# EAGLE design high-power-supply (EAGLE 7.7.0)
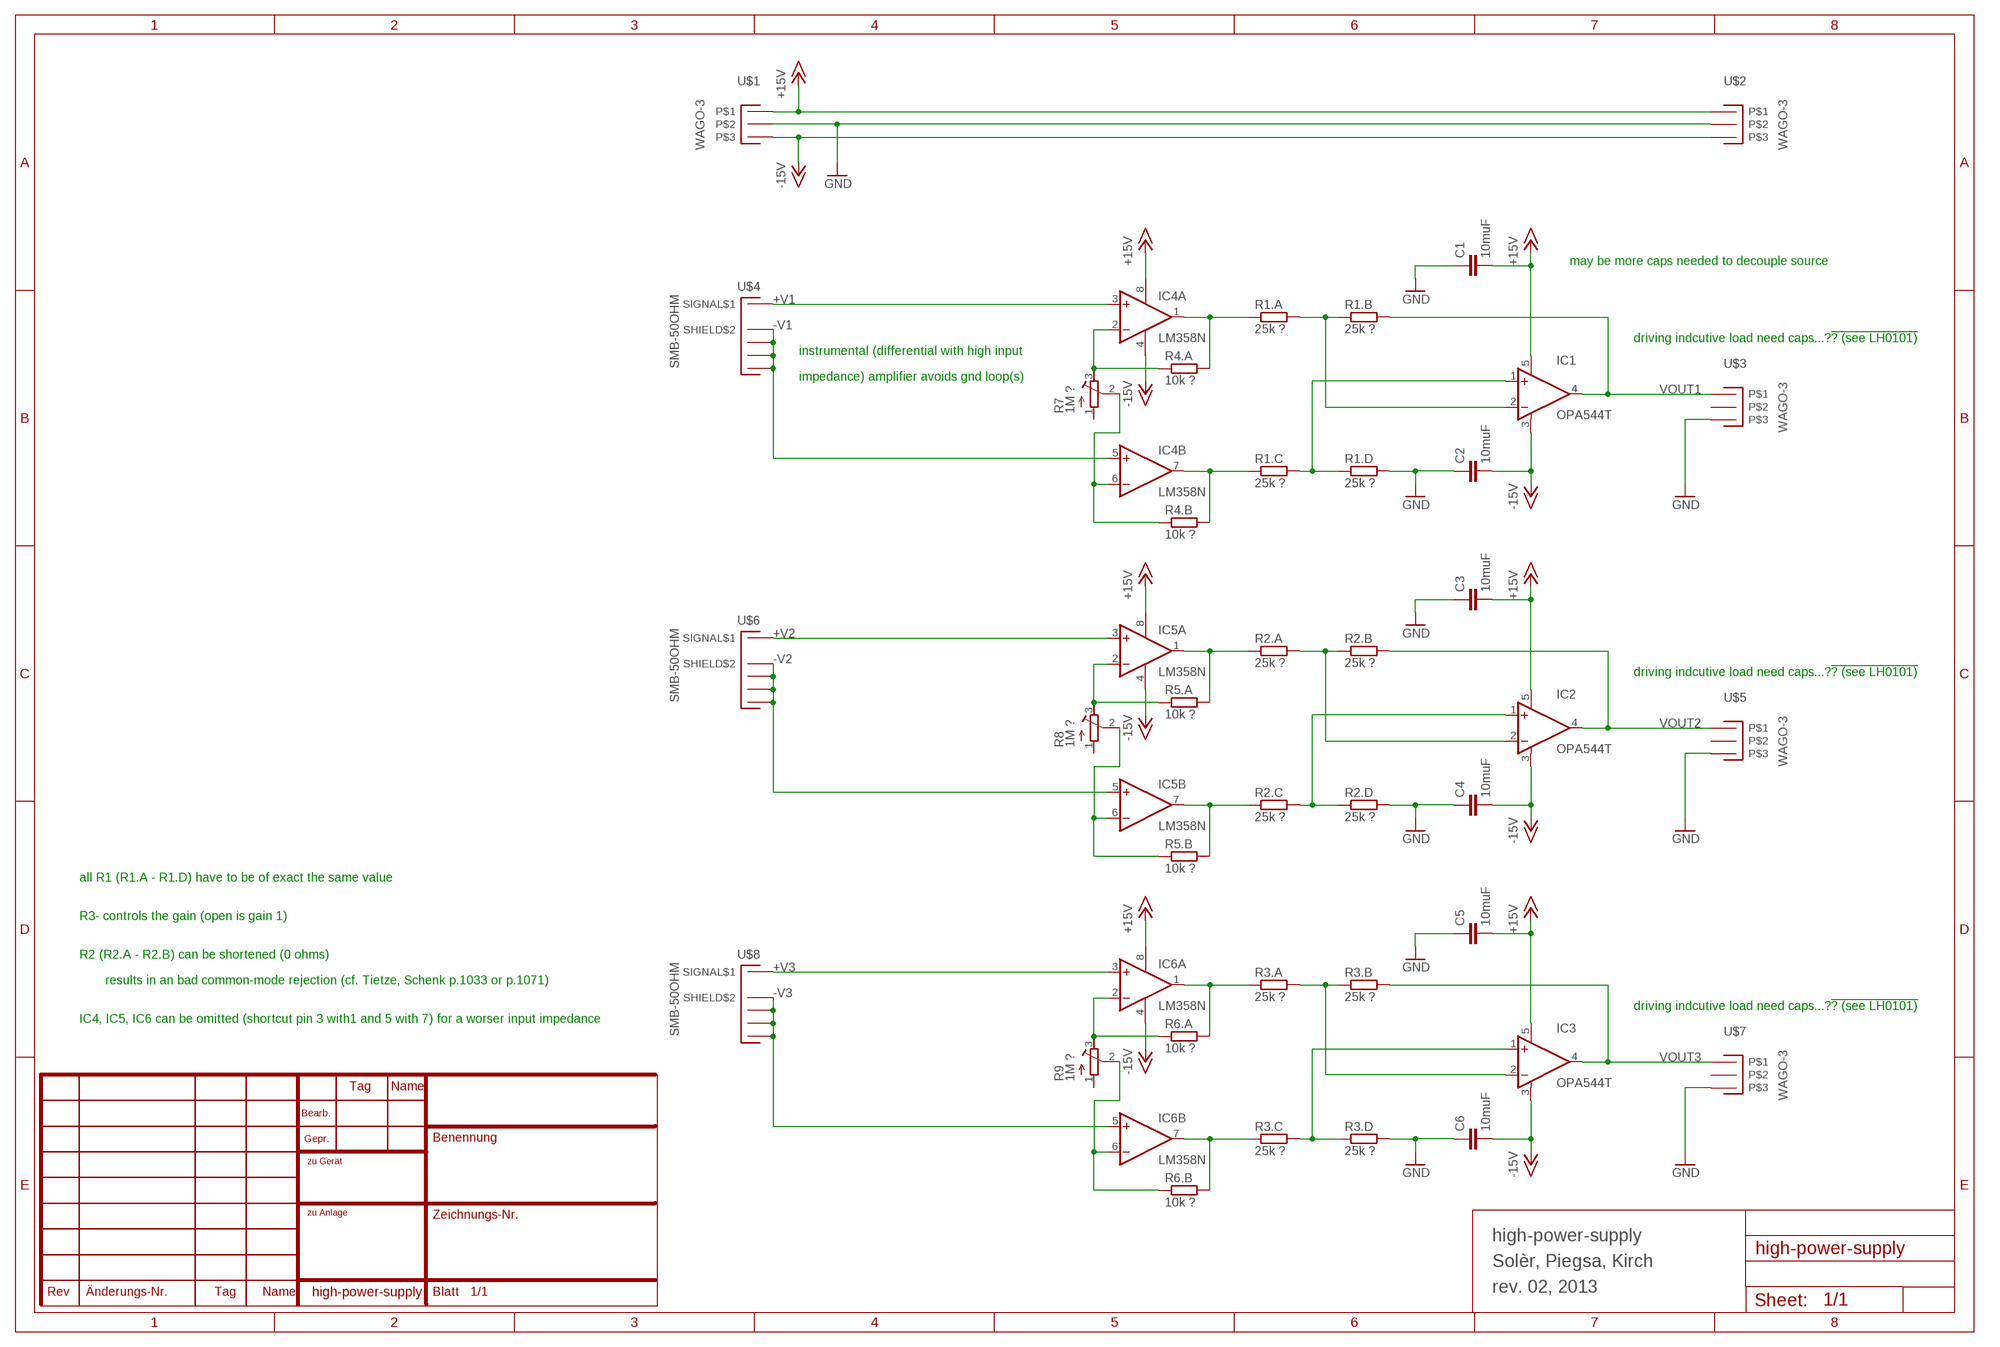
[diagram p0: schematic, sheet 1]

## Parts
C1  10muF  C-EU050-025X075  [C050-025X075]
C2  10muF  C-EU050-025X075  [C050-025X075]
C3  10muF  C-EU050-025X075  [C050-025X075]
C4  10muF  C-EU050-025X075  [C050-025X075]
C5  10muF  C-EU050-025X075  [C050-025X075]
C6  10muF  C-EU050-025X075  [C050-025X075]
IC1  OPA544T  [TO220-G5]
IC2  OPA544T  [TO220-G5]
IC3  OPA544T  [TO220-G5]
IC4  LM358N  [DIL08]
IC5  LM358N  [DIL08]
IC6  LM358N  [DIL08]
R1.A  25k ?  R-EU_0207/12  [0207/12]
R1.B  25k ?  R-EU_0207/12  [0207/12]
R1.C  25k ?  R-EU_0207/12  [0207/12]
R1.D  25k ?  R-EU_0207/12  [0207/12]
R2.A  25k ?  R-EU_0207/12  [0207/12]
R2.B  25k ?  R-EU_0207/12  [0207/12]
R2.C  25k ?  R-EU_0207/12  [0207/12]
R2.D  25k ?  R-EU_0207/12  [0207/12]
R3.A  25k ?  R-EU_0207/12  [0207/12]
R3.B  25k ?  R-EU_0207/12  [0207/12]
R3.C  25k ?  R-EU_0207/12  [0207/12]
R3.D  25k ?  R-EU_0207/12  [0207/12]
R4.A  10k ?  R-EU_0207/12  [0207/12]
R4.B  10k ?  R-EU_0207/12  [0207/12]
R5.A  10k ?  R-EU_0207/12  [0207/12]
R5.B  10k ?  R-EU_0207/12  [0207/12]
R6.A  10k ?  R-EU_0207/12  [0207/12]
R6.B  10k ?  R-EU_0207/12  [0207/12]
R7  1M ?  R-TRIMM3296Y  [RTRIM3296Y]
R8  1M ?  R-TRIMM3296Y  [RTRIM3296Y]
R9  1M ?  R-TRIMM3296Y  [RTRIM3296Y]
U$1  WAGO-3  [WAGO-3]
U$2  WAGO-3  [WAGO-3]
U$3  WAGO-3  [WAGO-3]
U$4  SMB-50OHM  [B-30]
U$5  WAGO-3  [WAGO-3]
U$6  SMB-50OHM  [B-30]
U$7  WAGO-3  [WAGO-3]
U$8  SMB-50OHM  [B-30]

## Nets
+15V: C1.2 C3.2 C5.2 IC1.5(V+) IC2.5(V+) IC3.5(V+) IC4.8(P:V+) IC5.8(P:V+) IC6.8(P:V+) U$1.P$1 U$2.P$1
+V1: IC4.3(A:+IN) U$4.P$1(SIGNAL$1)
+V2: IC5.3(A:+IN) U$6.P$1(SIGNAL$1)
+V3: IC6.3(A:+IN) U$8.P$1(SIGNAL$1)
-15V: C2.2 C4.2 C6.2 IC1.3(V-) IC2.3(V-) IC3.3(V-) IC4.4(P:V-) IC5.4(P:V-) IC6.4(P:V-) U$1.P$3 U$2.P$3
-V1: IC4.5(B:+IN) U$4.P$2(SHIELD$2) U$4.P$3(SHIELD$3) U$4.P$4(SHIELD$4) U$4.P$5(SHIELD$5)
-V2: IC5.5(B:+IN) U$6.P$2(SHIELD$2) U$6.P$3(SHIELD$3) U$6.P$4(SHIELD$4) U$6.P$5(SHIELD$5)
-V3: IC6.5(B:+IN) U$8.P$2(SHIELD$2) U$8.P$3(SHIELD$3) U$8.P$4(SHIELD$4) U$8.P$5(SHIELD$5)
GND: C1.1 C2.1 C3.1 C4.1 C5.1 C6.1 R1.D.2 R2.D.2 R3.D.2 U$1.P$2 U$2.P$2 U$3.P$3 U$5.P$3 U$7.P$3
N$2: IC1.2(-IN) R1.A.2 R1.B.1
N$4: IC1.1(+IN) R1.C.2 R1.D.1
N$10: IC4.2(A:-IN) R4.A.1 R7.3(E)
N$11: IC4.1(A:OUT) R1.A.1 R4.A.2
N$12: IC4.6(B:-IN) R4.B.1 R7.2(S)
N$13: IC4.7(B:OUT) R1.C.1 R4.B.2
N$16: IC5.2(A:-IN) R5.A.1 R8.3(E)
N$17: IC5.1(A:OUT) R2.A.1 R5.A.2
N$18: IC5.6(B:-IN) R5.B.1 R8.2(S)
N$19: IC5.7(B:OUT) R2.C.1 R5.B.2
N$20: IC2.2(-IN) R2.A.2 R2.B.1
N$21: IC2.1(+IN) R2.C.2 R2.D.1
N$24: IC6.2(A:-IN) R6.A.1 R9.3(E)
N$25: IC6.1(A:OUT) R3.A.1 R6.A.2
N$26: IC6.6(B:-IN) R6.B.1 R9.2(S)
N$27: IC6.7(B:OUT) R3.C.1 R6.B.2
N$28: IC3.2(-IN) R3.A.2 R3.B.1
N$29: IC3.1(+IN) R3.C.2 R3.D.1
VOUT1: IC1.4(OUT) R1.B.2 U$3.P$1
VOUT2: IC2.4(OUT) R2.B.2 U$5.P$1
VOUT3: IC3.4(OUT) R3.B.2 U$7.P$1
Unconnected: R7.1(A) R8.1(A) R9.1(A) U$3.P$2 U$5.P$2 U$7.P$2

## Notes on the sheet
- may be more caps needed to decouple source
- driving indcutive load need caps...?!? (see LH0101)
- instrumental (differential with high input
- impedance) amplifier avoids gnd loop(s)
- driving indcutive load need caps...?!? (see LH0101)
- all R1 (R1.A - R1.D) have to be of exact the same value
- R3- controls the gain (open is gain 1)
- R2 (R2.A - R2.B) can be shortened (0 ohms)
- results in an bad common-mode rejection (cf. Tietze, Schenk p.1033 or p.1071)
- driving indcutive load need caps...?!? (see LH0101)
- IC4, IC5, IC6 can be omitted (shortcut pin 3 with1 and 5 with 7) for a worser input impedance
- high-power-supply
- Solèr, Piegsa, Kirch
- rev. 02, 2013

## Library data of the parts
C1-C6 = rcl:C-EU: CAPACITOR, European symbol
IC1-IC3 = burr-brown:OPA544: Operational Amplifier High-Voltage, High-Current; MF: TEXAS INSTRUMENTS; MPN: OPA544T; OC_FARNELL: 1097575; OC_NEWARK: 36K2005
IC4-IC6 = linear:LM358: OP AMP also LM158; LM258; LM2904 Source: http://cache.national.com/ds/LM/LM158.pdf
R1.A R1.B R1.C R1.D R2.A R2.B R2.C R2.D R3.A R3.B R3.C R3.D R4.A R4.B R5.A R5.B R6.A R6.B = rcl:R-EU_: RESISTOR, European symbol
R7-R9 = rcl:R-TRIMM: Trimm resistor
U$1-U$3 U$5 U$7 = parts:WAGO-3
U$4 U$6 U$8 = parts:SMB-50OHM

## Board
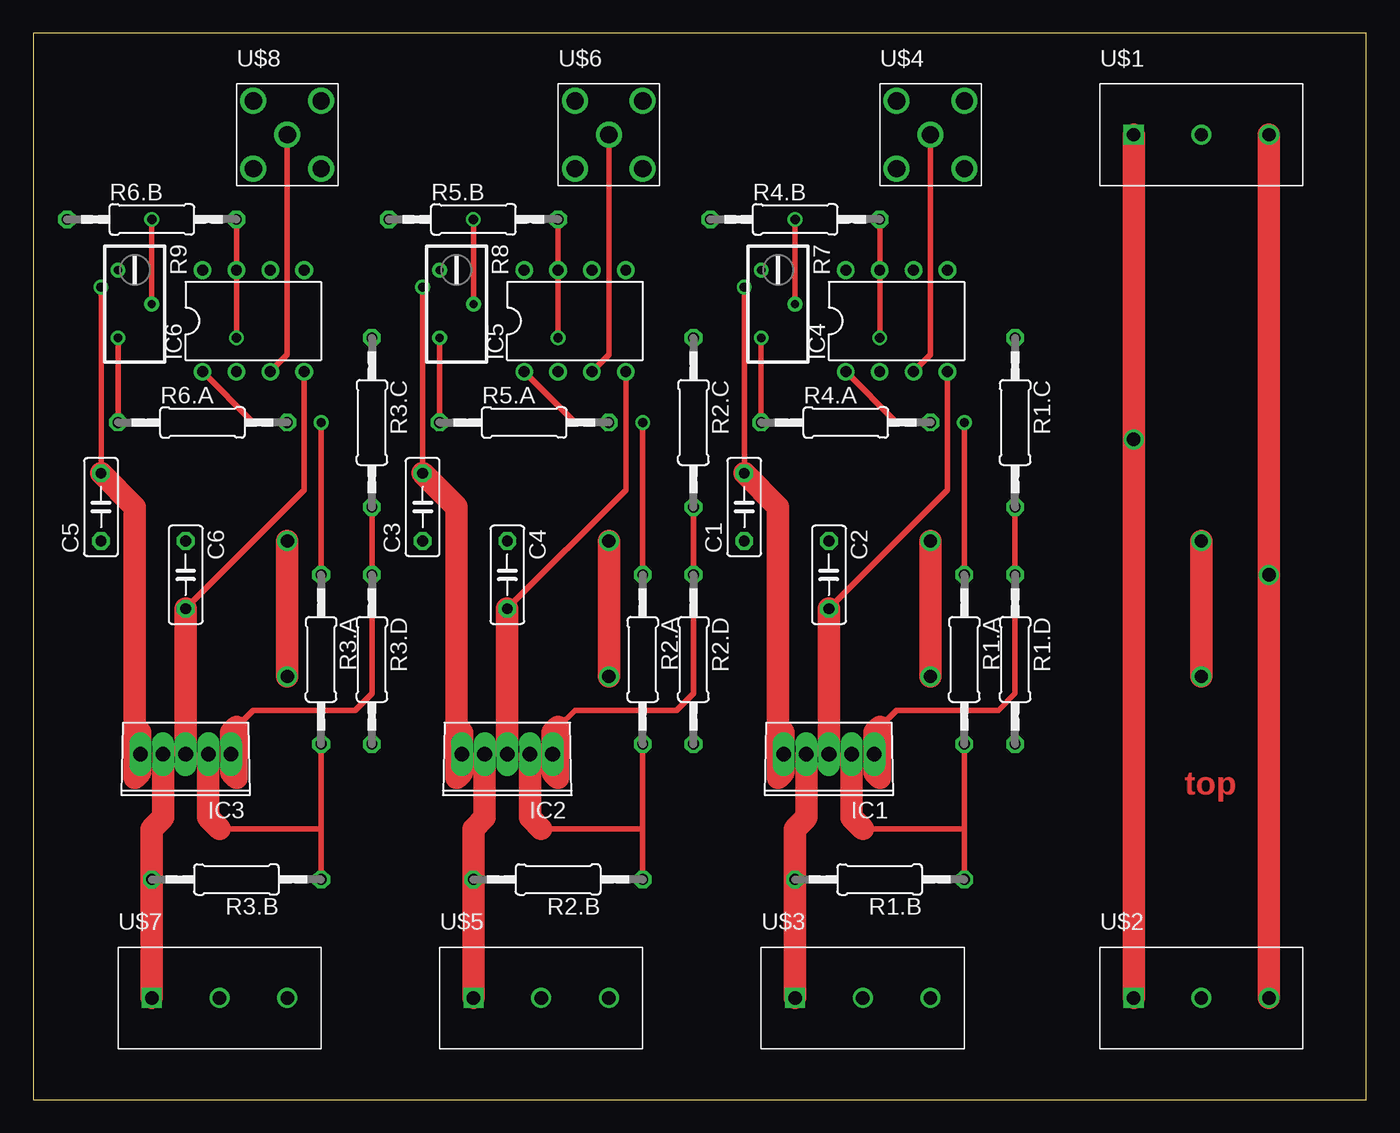
[diagram p1: board, top side]
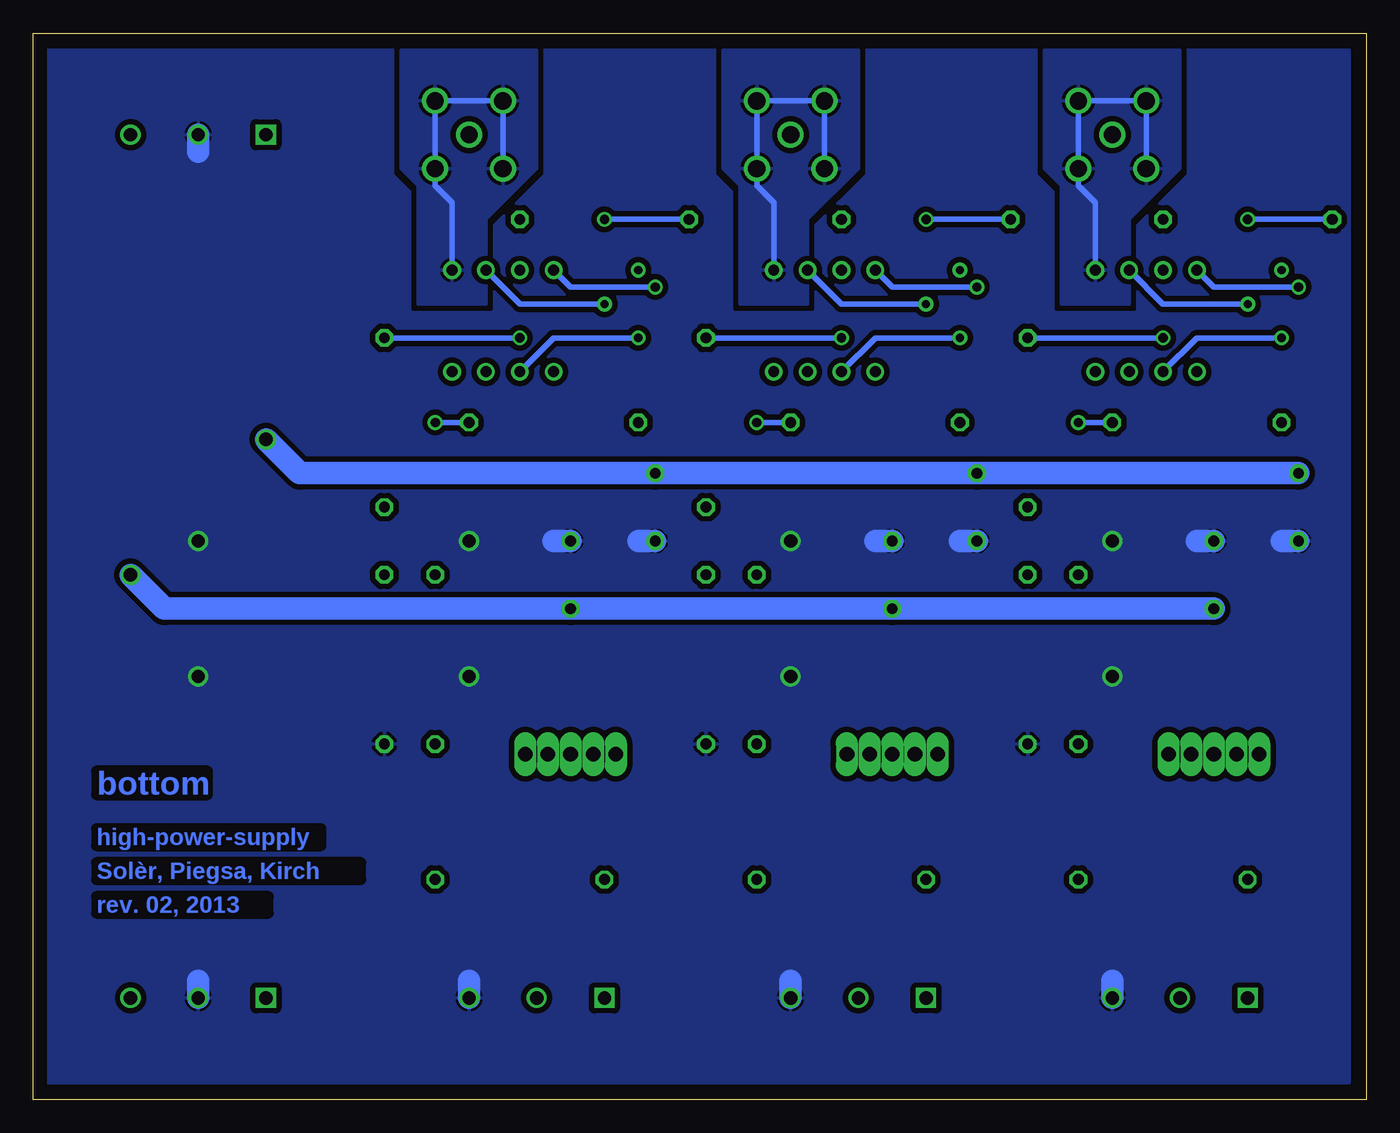
[diagram p2: board, bottom side, seen from below]

Size 100 x 80 mm. Coordinates in mm from the lower left corner, seen from the top.
Outline: 0,0 100,0 100,80 0,80 0,0
Copper layers (1*16): Top 0.035mm / dielectric 1.5mm / Bottom 0.035mm
Design rules "default": minimum track width 10mil, minimum drill 24mil, track to track 8mil, track to pad 8mil, pad to pad 8mil, via to via 8mil, smd to smd 8mil, copper to edge 40mil, drill to drill 8mil, minimum pad ring 10mil, minimum via ring 8mil, stop-mask expansion 4mil, vias tented up to drill 0mil, thermal gap 10mil

### Footprints (pad centres in the part's own frame; a part is rotated, then mirrored left to right if it is on the bottom)
C050-025X075 = drill 0.813 octagon: 1 -2.54,0; 2 2.54,0
TO220-G5 = drill 1.1 pad 1.27 long: 1 -3.4,-3.048; 2 -1.7,-3.048; 3 0,-3.048; 4 1.7,-3.048; 5 3.4,-3.048
DIL08 = drill 0.813 pad 1.27: 1 -3.81,-3.81; 2 -1.27,-3.81; 3 1.27,-3.81; 4 3.81,-3.81; 5 3.81,3.81; 6 1.27,3.81; 7 -1.27,3.81; 8 -3.81,3.81
0207/12 = drill 0.813 octagon: 1 -6.35,0; 2 6.35,0
RTRIM3296Y = drill 0.61: 1 1.27,-2.54; 2 -1.27,0; 3 1.27,2.54
WAGO-3 = drill 1 square: P$1 -5.08,0 | drill 1: P$2 0,0; P$3 5.08,0
B-30 = drill 1.3: P$1 0,0; P$2 -2.54,2.54; P$3 -2.54,-2.54; P$4 2.54,-2.54; P$5 2.54,2.54

### Placement (x,y rotation side)
C1  53.34,44.45 90 top
C2  59.69,39.37 270 top
C3  29.21,44.45 90 top
C4  35.56,39.37 270 top
C5  5.08,44.45 90 top
C6  11.43,39.37 270 top
IC1  59.69,22.86 180 top
IC2  35.56,22.86 180 top
IC3  11.43,22.86 180 top
IC4  64.77,58.42 0 top
IC5  40.64,58.42 0 top
IC6  16.51,58.42 0 top
R1.A  69.85,33.02 270 top
R1.B  63.5,16.51 180 top
R1.C  73.66,50.8 270 top
R1.D  73.66,33.02 270 top
R2.A  45.72,33.02 270 top
R2.B  39.37,16.51 180 top
R2.C  49.53,50.8 270 top
R2.D  49.53,33.02 270 top
R3.A  21.59,33.02 270 top
R3.B  15.24,16.51 180 top
R3.C  25.4,50.8 270 top
R3.D  25.4,33.02 270 top
R4.A  60.96,50.8 0 top
R4.B  57.15,66.04 0 top
R5.A  36.83,50.8 0 top
R5.B  33.02,66.04 0 top
R6.A  12.7,50.8 0 top
R6.B  8.89,66.04 0 top
R7  55.88,59.69 180 top
R8  31.75,59.69 180 top
R9  7.62,59.69 180 top
U$1  87.63,72.39 0 top
U$2  87.63,7.62 0 top
U$3  62.23,7.62 0 top
U$4  67.31,72.39 0 top
U$5  38.1,7.62 0 top
U$6  43.18,72.39 0 top
U$7  13.97,7.62 0 top
U$8  19.05,72.39 0 top

### Tracks (layer width: path | path; a pad name or v marks a point on that pad's centre or on a via)
+15V  (via drill 0.7, 1)
  Top 0.406: C5.2 v5.08,60.96 | C3.2 v29.21,60.96 | C1.2 v53.34,60.96
  Top 1.676: 55.88,27.94 56.29,27.53 IC1.5 56.29,24.54 55.88,24.13 55.88,27.94 | 55.88,27.94 55.88,44.45 C1.2 | 31.75,27.94 32.16,27.53 IC2.5 32.16,24.54 31.75,24.13 31.75,44.45 C3.2 | 7.62,27.94 8.03,27.53 IC3.5 8.03,24.54 7.62,24.13 7.62,44.45 C5.2 | U$2.P$1 v82.55,49.53 U$1.P$1
  Bottom 0.406: IC6.8 11.43,60.96 v5.08,60.96 | v29.21,60.96 35.56,60.96 IC5.8 | v53.34,60.96 59.69,60.96 IC4.8
  Bottom 1.676: v82.55,49.53 80.01,46.99 C1.2 C3.2 C5.2
+V1
  Top 0.406: IC4.3 67.31,55.88 U$4.P$1
+V2
  Top 0.406: IC5.3 43.18,55.88 U$6.P$1
+V3
  Top 0.406: IC6.3 19.05,55.88 U$8.P$1
-15V  (via drill 1)
  Top 0.406: IC6.4 20.32,45.72 C6.2 | IC5.4 44.45,45.72 C4.2 | IC4.4 68.58,45.72 C2.2
  Top 1.676: C2.2 IC1.3 | C4.2 IC2.3 | IC3.3 C6.2 | U$2.P$3 v92.71,39.37 U$1.P$3
  Bottom 1.676: v92.71,39.37 90.17,36.83 C2.2 C4.2 C6.2
-V1
  Bottom 0.406: IC4.5 68.58,67.31 69.85,68.58 U$4.P$4 U$4.P$5 U$4.P$2 U$4.P$3
  pour Bottom (isolate 0.406): 62.23,78.74 72.39,78.74 72.39,69.85 71.12,68.58 71.12,59.69 66.04,59.69 66.04,66.04 62.23,69.85
-V2
  Bottom 0.406: U$6.P$3 U$6.P$2 U$6.P$5 U$6.P$4 45.72,68.58 44.45,67.31 IC5.5
  pour Bottom (isolate 0.406): 38.1,78.74 48.26,78.74 48.26,69.85 46.99,68.58 46.99,59.69 41.91,59.69 41.91,66.04 38.1,69.85
-V3
  Bottom 0.406: IC6.5 20.32,67.31 21.59,68.58 U$8.P$4 U$8.P$5 U$8.P$2 U$8.P$3
  pour Bottom (isolate 0.406): 13.97,78.74 24.13,78.74 24.13,69.85 22.86,68.58 22.86,59.69 17.78,59.69 17.78,66.04 13.97,69.85
GND  (via drill 1)
  Top 1.676: v67.31,31.75 v67.31,41.91 | v43.18,31.75 v43.18,41.91 | v19.05,31.75 v19.05,41.91 | v87.63,31.75 v87.63,41.91
  Bottom 1.676: U$3.P$3 67.31,8.89 | U$2.P$2 87.63,8.89 | U$1.P$2 87.63,71.12 | U$5.P$3 43.18,8.89 | U$7.P$3 19.05,8.89 | C1.1 54.61,41.91 | C2.1 60.96,41.91 | C4.1 36.83,41.91 | C3.1 30.48,41.91 | C6.1 12.7,41.91 | C5.1 6.35,41.91
  pour Bottom (isolate 0.406, rank 2): 1.27,78.74 99.06,78.74 99.06,1.27 1.27,1.27
N$2
  Top 0.406: 69.85,20.32 R1.A.2 | 62.23,20.32 69.85,20.32 | 69.85,20.32 R1.B.1
  Top 1.676: IC1.2 61.39,21.16 62.23,20.32
N$4
  Top 0.406: R1.C.2 R1.D.1 73.66,30.48 72.39,29.21 64.77,29.21 63.09,27.53
  Top 1.676: IC1.1 63.09,27.53 63.5,27.94 63.5,24.13 63.09,24.54 IC1.1
N$10
  Top 0.406: R4.A.1 R7.3
  Bottom 0.406: R7.3 60.96,57.15 IC4.2
N$11  (via drill 0.7)
  Top 0.406: IC4.1 64.77,50.8 R4.A.2 | R1.A.1 v69.85,50.8
  Bottom 0.406: v69.85,50.8 R4.A.2
N$12  (via drill 0.7)
  Top 0.406: R7.2 v57.15,66.04
  Bottom 0.406: R7.2 63.5,59.69 IC4.6 | v57.15,66.04 R4.B.1
N$13  (via drill 0.7)
  Top 0.406: R4.B.2 IC4.7 v63.5,57.15
  Bottom 0.406: v63.5,57.15 R1.C.1
N$16
  Top 0.406: R5.A.1 R8.3
  Bottom 0.406: R8.3 36.83,57.15 IC5.2
N$17  (via drill 0.7)
  Top 0.406: IC5.1 40.64,50.8 R5.A.2 | R2.A.1 v45.72,50.8
  Bottom 0.406: v45.72,50.8 R5.A.2
N$18  (via drill 0.7)
  Top 0.406: R8.2 v33.02,66.04
  Bottom 0.406: R8.2 39.37,59.69 IC5.6 | v33.02,66.04 R5.B.1
N$19  (via drill 0.7)
  Top 0.406: R5.B.2 IC5.7 v39.37,57.15
  Bottom 0.406: v39.37,57.15 R2.C.1
N$20
  Top 0.406: 45.72,20.32 R2.B.1 | 45.72,20.32 R2.A.2 | 38.1,20.32 45.72,20.32
  Top 1.676: IC2.2 37.26,21.16 38.1,20.32
N$21
  Top 0.406: R2.C.2 R2.D.1 49.53,30.48 48.26,29.21 40.64,29.21 39.37,27.94
  Top 1.676: 38.96,24.54 IC2.1 38.96,27.53 39.37,27.94 39.37,24.13 38.96,24.54
N$24
  Top 0.406: R6.A.1 R9.3
  Bottom 0.406: R9.3 12.7,57.15 IC6.2
N$25  (via drill 0.7)
  Top 0.406: IC6.1 16.51,50.8 R6.A.2 | R3.A.1 v21.59,50.8
  Bottom 0.406: v21.59,50.8 R6.A.2
N$26  (via drill 0.7)
  Top 0.406: R9.2 v8.89,66.04
  Bottom 0.406: R9.2 15.24,59.69 IC6.6 | v8.89,66.04 R6.B.1
N$27  (via drill 0.7)
  Top 0.406: R6.B.2 IC6.7 v15.24,57.15
  Bottom 0.406: v15.24,57.15 R3.C.1
N$28
  Top 0.406: 21.59,20.32 R3.B.1 | 21.59,20.32 R3.A.2 | 13.97,20.32 21.59,20.32
  Top 1.676: IC3.2 13.13,21.16 13.97,20.32
N$29
  Top 0.406: R3.C.2 R3.D.1 25.4,30.48 24.13,29.21 16.51,29.21 15.24,27.94
  Top 1.676: 14.83,24.54 IC3.1 14.83,27.53 15.24,27.94 15.24,24.13 14.83,24.54
VOUT1
  Top 1.676: IC1.4 57.99,21.16 57.15,20.32 R1.B.2 U$3.P$1
VOUT2
  Top 1.676: IC2.4 33.86,21.16 33.02,20.32 R2.B.2 U$5.P$1
VOUT3
  Top 1.676: IC3.4 9.73,21.16 8.89,20.32 R3.B.2 U$7.P$1

### Text on the board
Top: top
Bottom: bottom | high-power-supply | Solèr, Piegsa, Kirch | rev. 02, 2013